# Altium project roneMotorBoard-v9.PrjPCB
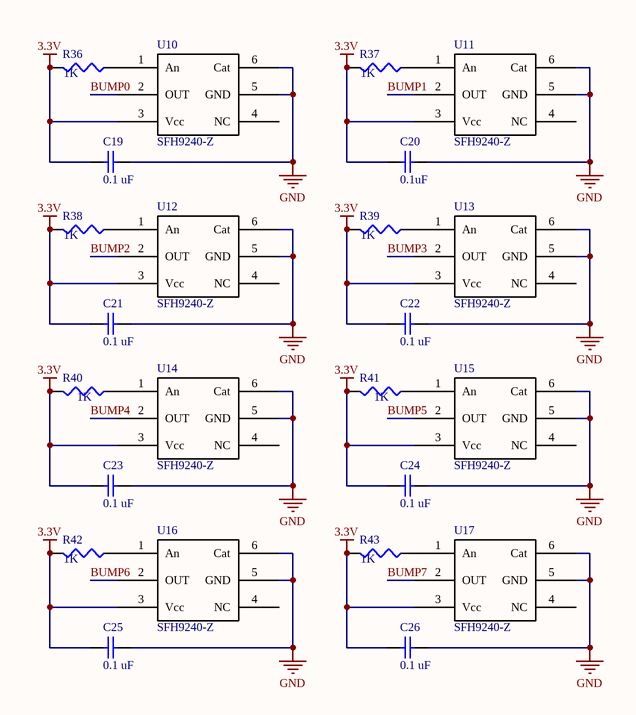
[diagram p0: BumpSensors.SchDoc]
6 sheets, 104 parts. Net scope: global (net labels, ports and power ports of the same name join across sheets).
Board file: roneMotorBoard-v9.PcbDoc
Sheets:
  BumpSensors.SchDoc
  GyroAccelHeaders.SchDoc
  LineCliffSensors.SchDoc
  motorEncoder.SchDoc
  MSP430.SchDoc
  Power.SchDoc

## Sheet BumpSensors.SchDoc
size A

### Parts
C19  value 0.1 uF  [CAPC1005L]  (hidden comment: Cap Semi)
C20  value 0.1uF  [CAPC1005L]  (hidden comment: Cap Semi)
C21  value 0.1 uF  [CAPC1005L]  (hidden comment: Cap Semi)
C22  value 0.1 uF  [CAPC1005L]  (hidden comment: Cap Semi)
C23  value 0.1 uF  [CAPC1005L]  (hidden comment: Cap Semi)
C24  value 0.1 uF  [CAPC1005L]  (hidden comment: Cap Semi)
C25  value 0.1 uF  [CAPC1005L]  (hidden comment: Cap Semi)
C26  value 0.1 uF  [CAPC1005L]  (hidden comment: Cap Semi)
R36  value 1K  [RESC1608L]  (hidden comment: Res3)
R37  value 1K  [RESC1608L]  (hidden comment: Res3)
R38  value 1K  [RESC1608L]  (hidden comment: Res3)
R39  value 1K  [RESC1608L]  (hidden comment: Res3)
R40  value 1K  [RESC1608L]  (hidden comment: Res3)
R41  value 1K  [RESC1608L]  (hidden comment: Res3)
R42  value 1K  [RESC1608L]  (hidden comment: Res3)
R43  value 1K  [RESC1608L]  (hidden comment: Res3)
U10  SFH9240-Z  [SFH9240-Z]
U11  SFH9240-Z  [SFH9240-Z]
U12  SFH9240-Z  [SFH9240-Z]
U13  SFH9240-Z  [SFH9240-Z]
U14  SFH9240-Z  [SFH9240-Z]
U15  SFH9240-Z  [SFH9240-Z]
U16  SFH9240-Z  [SFH9240-Z]
U17  SFH9240-Z  [SFH9240-Z]

### Nets
3.3V: C19.2 C20.2 C21.2 C22.2 C23.2 C24.2 C25.2 C26.2 R36.2 R37.2 R38.2 R39.2 R40.2 R41.2 R42.2 R43.2 U10.3(Vcc) U11.3(Vcc) U12.3(Vcc) U13.3(Vcc) U14.3(Vcc) U15.3(Vcc) U16.3(Vcc) U17.3(Vcc)
GND: C19.1 C20.1 C21.1 C22.1 C23.1 C24.1 C25.1 C26.1 U10.5(GND) U10.6(Cat) U11.5(GND) U11.6(Cat) U12.5(GND) U12.6(Cat) U13.5(GND) U13.6(Cat) U14.5(GND) U14.6(Cat) U15.5(GND) U15.6(Cat) U16.5(GND) U16.6(Cat) U17.5(GND) U17.6(Cat)
BUMP0: U10.2(OUT)
BUMP1: U11.2(OUT)
BUMP2: U12.2(OUT)
BUMP3: U13.2(OUT)
BUMP4: U14.2(OUT)
BUMP5: U15.2(OUT)
BUMP6: U16.2(OUT)
BUMP7: U17.2(OUT)
NetR36_1: R36.1 U10.1(An)
NetR37_1: R37.1 U11.1(An)
NetR38_1: R38.1 U12.1(An)
NetR39_1: R39.1 U13.1(An)
NetR40_1: R40.1 U14.1(An)
NetR41_1: R41.1 U15.1(An)
NetR42_1: R42.1 U16.1(An)
NetR43_1: R43.1 U17.1(An)

Not connected (* = marked no-connect by the designer): U10 4(NC); U11 4(NC); U12 4(NC); U13 4(NC); U14 4(NC); U15 4(NC); U16 4(NC); U17 4(NC)

### Library data of the parts
C19-C26 = Cap Semi: Capacitor (Semiconductor SIM Model); Published: 8-Jun-2000; LatestRevisionDate: 29-May-2009; LatestRevisionNote: IPC-7351 Footprint Added.; PackageReference: C1206; Publisher: Altium Limited; PackageDescription: Chip Capacitor
R36-R43 = Res3: Resistor; Published: 8-Jun-2000; LatestRevisionDate: 29-May-2009; LatestRevisionNote: IPC-7351 Footprint Added.; PackageReference: J1-0603; Publisher: Altium Limited; PackageDescription: Chip Resistor

## Sheet GyroAccelHeaders.SchDoc
size A
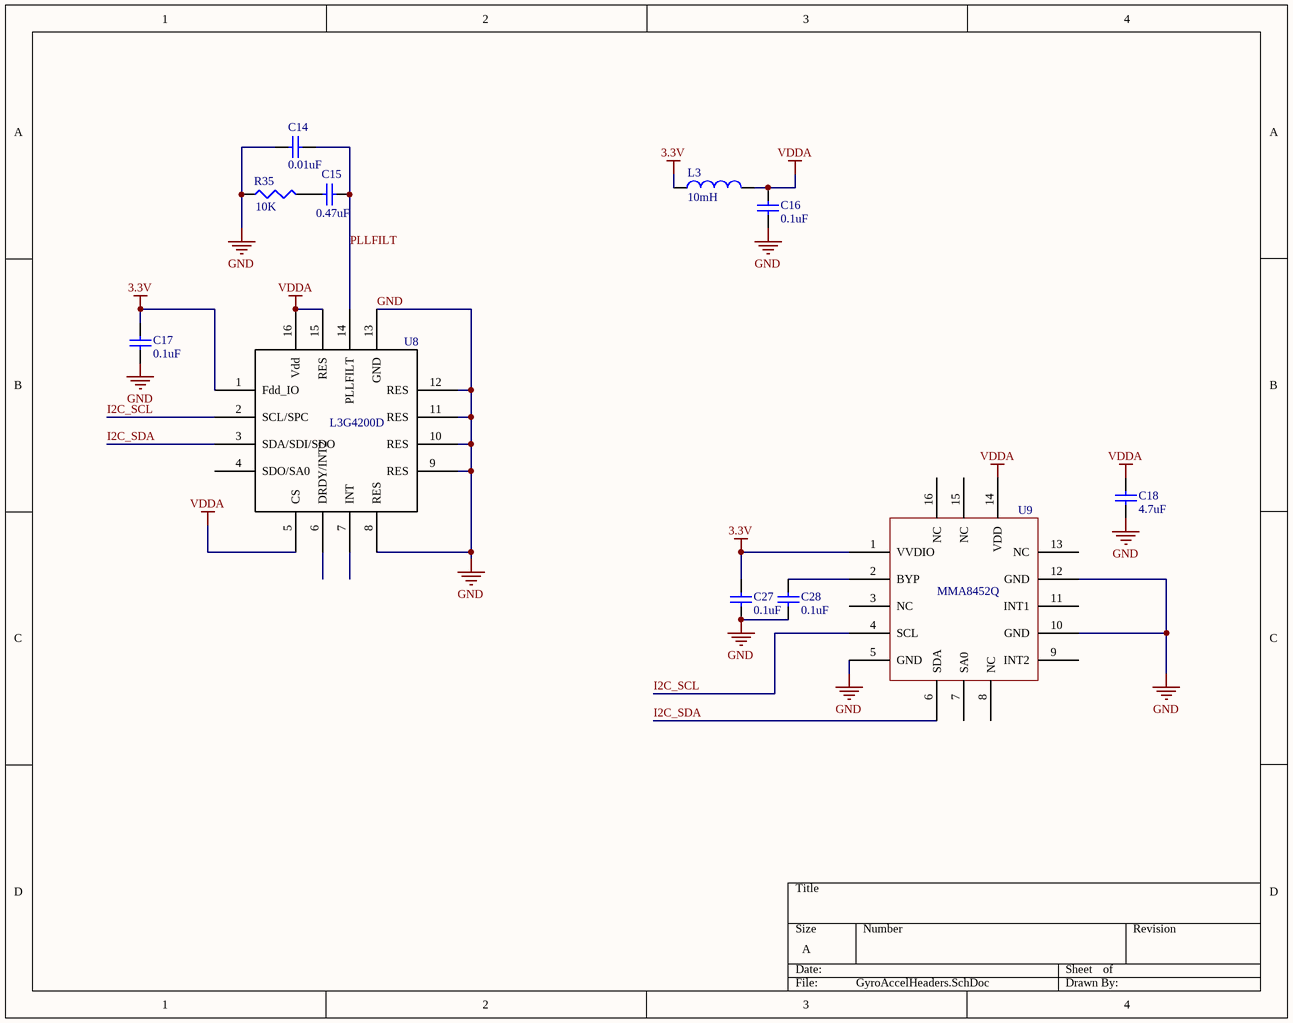
[diagram p1: GyroAccelHeaders.SchDoc]

### Parts
C14  value 0.01uF  [CAPC1005L]  (hidden comment: Cap Semi)
C15  value 0.47uF  [CAPC1005L]  (hidden comment: Cap Semi)
C16  value 0.1uF  [CAPC1005L]  (hidden comment: Cap Semi)
C17  value 0.1uF  [CAPC1005L]  (hidden comment: Cap Semi)
C18  value 4.7uF  [CAPC1005L]  (hidden comment: Cap Semi)
C27  value 0.1uF  [CAPC1005L]  (hidden comment: Cap Semi)
C28  value 0.1uF  [CAPC1005L]  (hidden comment: Cap Semi)
L3  value 10mH  [INDC2012L]  (hidden comment: Inductor)
R35  value 10K  [RESC1608L]  (hidden comment: Res3)
U8  L3G4200D  [L3G2004D]
U9  MMA8452Q  [MMA8452Q]

### Nets
3.3V: C17.2 C27.2 L3.2 U8.1(Fdd_IO) U9.1(VVDIO)
GND: C14.2 C16.1 C17.1 C18.1 C27.1 C28.1 R35.1 U8.8(RES) U8.9(RES) U8.10(RES) U8.11(RES) U8.12(RES) U8.13(GND) U9.5(GND) U9.10(GND) U9.12(GND)
VDDA: C16.2 C18.2 L3.1 U8.5(CS) U8.15(RES) U8.16(Vdd) U9.14(VDD)
I2C_SCL: U8.2(SCL/SPC) U9.4(SCL)
I2C_SDA: U8.3(SDA/SDI/SDO) U9.6(SDA)
PLLFILT: C14.1 C15.1 U8.14(PLLFILT)
NetC15_2: C15.2 R35.2
NetC28_2: C28.2 U9.2(BYP)

Not connected (* = marked no-connect by the designer): U8 4(SDO/SA0) 6(DRDY/INT2) 7(INT); U9 3(NC) 7(SA0) 8(NC) 9(INT2) 11(INT1) 13(NC) 15(NC) 16(NC)

### Library data of the parts
C14-C18 C27 C28 = Cap Semi: Capacitor (Semiconductor SIM Model); Published: 8-Jun-2000; LatestRevisionDate: 29-May-2009; LatestRevisionNote: IPC-7351 Footprint Added.; PackageReference: C1206; Publisher: Altium Limited; PackageDescription: Chip Capacitor
L3 = Inductor: Code_IEC: 1005; Published: 8-Jun-2000; LatestRevisionDate: 29-May-2009; LatestRevisionNote: IPC-7351 Footprint Added.; PackageReference: 0402-A; Publisher: Altium Limited; PackageDescription: Chip Inductor; Code_JEITA: 0402
R35 = Res3: Resistor; Published: 8-Jun-2000; LatestRevisionDate: 29-May-2009; LatestRevisionNote: IPC-7351 Footprint Added.; PackageReference: J1-0603; Publisher: Altium Limited; PackageDescription: Chip Resistor
U8 = L3G4200D: 3axis gyroscope, SPI

## Sheet LineCliffSensors.SchDoc
size A
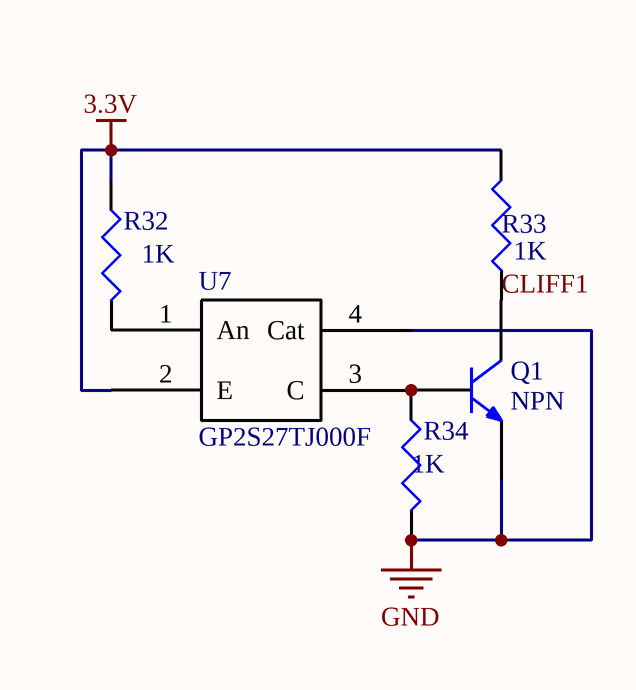
[diagram p2: LineCliffSensors.SchDoc]

### Parts
Q1  NPN  [SOT-23]
R32  value 1K  [RESC1608L]  (hidden comment: Res3)
R33  value 1K  [RESC1608L]  (hidden comment: Res3)
R34  value 1K  [RESC1608L]  (hidden comment: Res3)
U7  GP2S27TJ000F  [GP2S27J0000F]

### Nets
3.3V: R32.1 R33.2 U7.2(E)
GND: Q1.2(E) R34.2 U7.4(Cat)
CLIFF1: Q1.3(C) R33.1
NetQ1_1: Q1.1(B) R34.1 U7.3(C)
NetR32_2: R32.2 U7.1(An)

### Library data of the parts
R32-R34 = Res3: Resistor; Published: 8-Jun-2000; LatestRevisionDate: 29-May-2009; LatestRevisionNote: IPC-7351 Footprint Added.; PackageReference: J1-0603; Publisher: Altium Limited; PackageDescription: Chip Resistor

## Sheet motorEncoder.SchDoc
size A
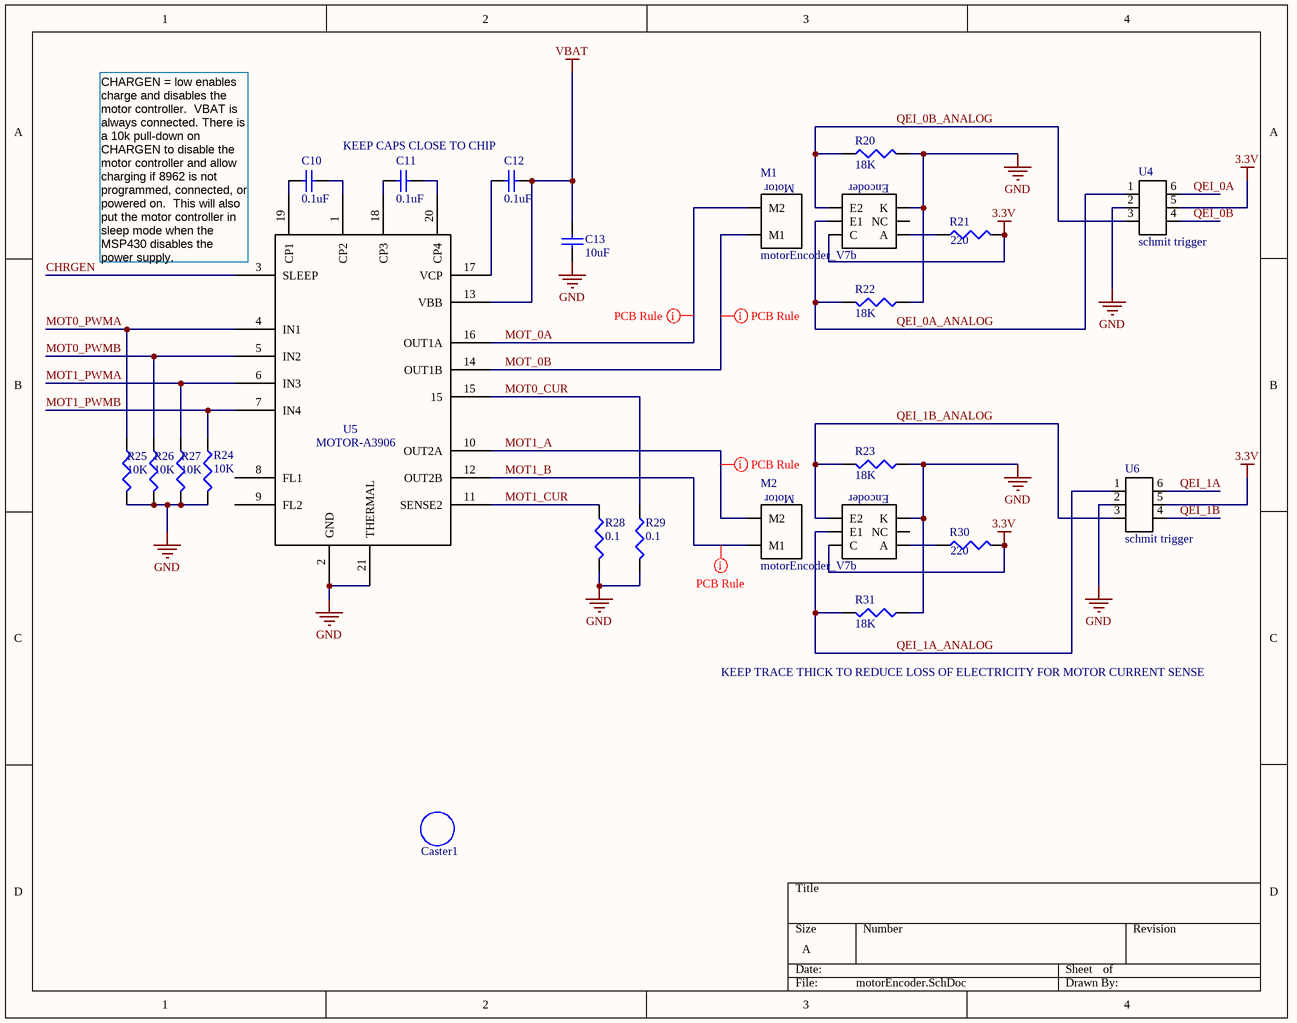
[diagram p3: motorEncoder.SchDoc]

### Parts
C10  value 0.1uF  [CAPC1005L]  (hidden comment: Cap Semi)
C11  value 0.1uF  [CAPC1005L]  (hidden comment: Cap Semi)
C12  value 0.1uF  [CAPC1005L]  (hidden comment: Cap Semi)
C13  value 10uF  [CAPC1608L]  (hidden comment: Cap Semi)
Caster1  non connect  [3/4"CASTER2]  (value not drawn)
M1  motorEncoder_V7b  [motorEncoder_V7b]
M2  motorEncoder_V7b  [motorEncoder_V7b]
R20  value 18K  [RESC1608L]
R21  value 220  [RESC1608L]
R22  value 18K  [RESC1608L]
R23  value 18K  [RESC1608L]
R24  value 10K  [RESC1608L]  (hidden comment: Res3)
R25  value 10K  [RESC1608L]  (hidden comment: Res3)
R26  value 10K  [RESC1608L]  (hidden comment: Res3)
R27  value 10K  [RESC1608L]  (hidden comment: Res3)
R28  value 0.1  [RESC1608L]  (hidden comment: Res3)
R29  value 0.1  [RESC1608L]  (hidden comment: Res3)
R30  value 220  [RESC1608L]
R31  value 18K  [RESC1608L]
U4  schmit trigger  [DCK(R-PDSO-C6)]
U5  MOTOR-A3906  [QFN-20]
U6  schmit trigger  [DCK(R-PDSO-C6)]

### Nets
3.3V: M1.C M2.C R21.2 R30.2 U4.5 U6.5
GND: C13.1 M1.K M2.K R20.2 R22.1 R23.1 R24.2 R25.2 R26.2 R27.2 R28.2 R29.2 R31.1 U4.2 U5.2(GND) U5.21(THERMAL) U6.2
VBAT: C12.1 C13.2 U5.13(VBB)
CHRGEN: U5.3(SLEEP)
MOT0_CUR: R29.1 U5.15
MOT0_PWMA: R25.1 U5.4(IN1)
MOT0_PWMB: R26.1 U5.5(IN2)
MOT1_A: M2.M2 U5.10(OUT2A)
MOT1_B: M2.M1 U5.12(OUT2B)
MOT1_CUR: R28.1 U5.11(SENSE2)
MOT1_PWMA: R27.1 U5.6(IN3)
MOT1_PWMB: R24.1 U5.7(IN4)
MOT_0A: M1.M2 U5.16(OUT1A)
MOT_0B: M1.M1 U5.14(OUT1B)
QEI_0A: U4.6
QEI_0A_ANALOG: M1.E1 R22.2 U4.1
QEI_0B: U4.4
QEI_0B_ANALOG: M1.E2 R20.1 U4.3
QEI_1A: U6.6
QEI_1A_ANALOG: M2.E1 R31.2 U6.1
QEI_1B: U6.4
QEI_1B_ANALOG: M2.E2 R23.2 U6.3
NetC10_1: C10.1 U5.19(CP1)
NetC10_2: C10.2 U5.1(CP2)
NetC11_1: C11.1 U5.18(CP3)
NetC11_2: C11.2 U5.20(CP4)
NetC12_2: C12.2 U5.17(VCP)
NetM1_A: M1.A R21.1
NetM2_A: M2.A R30.1

Not connected (* = marked no-connect by the designer): M1 NC; M2 NC; U5 8(FL1) 9(FL2)

### Layout directives
rule Width Constraint [Pref Width = 20mil    Min Width = 10mil    Max Width = 25mil]: MOT1_A, MOT1_B, MOT_0A, MOT_0B

### Notes on the sheet
- KEEP CAPS CLOSE TO CHIP
- (near U5) CHARGEN = low enables charge and disables the motor controller.  VBAT is always connected. There is a 10k pull-down on CHARGEN to disable the motor controller and allow charging if 8962 is not programmed, connected, or powered on.  This will also put the motor controller in sleep mode when the MSP430 disables the power supply.
- KEEP TRACE THICK TO REDUCE LOSS OF ELECTRICITY FOR MOTOR CURRENT SENSE
- (in symbol motorEncoder_V7b) Motor; Encoder

### Library data of the parts
C10-C13 = Cap Semi: Capacitor (Semiconductor SIM Model); Published: 8-Jun-2000; LatestRevisionDate: 29-May-2009; LatestRevisionNote: IPC-7351 Footprint Added.; PackageReference: C1206; Publisher: Altium Limited; PackageDescription: Chip Capacitor
Caster1 = Caster 3/4in: This is just a space saver to get the caster onto the pcb
R20-R31 = Res3: Resistor; Published: 8-Jun-2000; LatestRevisionDate: 29-May-2009; LatestRevisionNote: IPC-7351 Footprint Added.; PackageReference: J1-0603; Publisher: Altium Limited; PackageDescription: Chip Resistor

## Sheet MSP430.SchDoc
size A
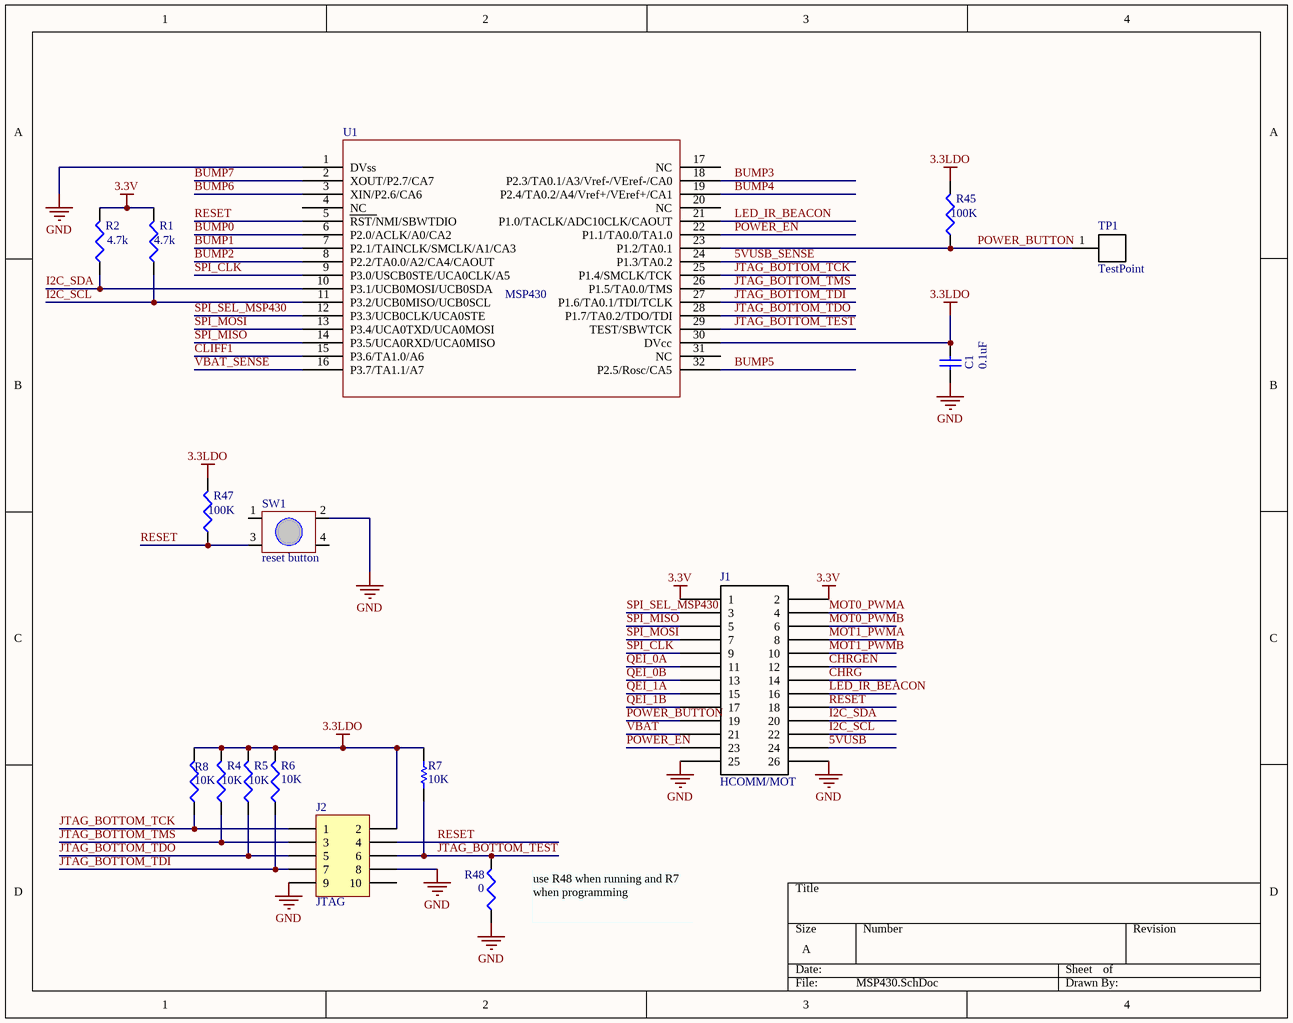
[diagram p4: MSP430.SchDoc]

### Parts
C1  value 0.1uF  [CAPC1005L]  (hidden comment: Cap Semi)
J1  HCOMM/MOT  [HeaderSM 13x2]
J2  JTAG  [HDR2X5]
R1  value 4.7k  [RESC1608L]  (hidden comment: Res3)
R2  value 4.7k  [RESC1608L]  (hidden comment: Res3)
R4  value 10K  [RESC1608L]  (hidden comment: Res3)
R5  value 10K  [RESC1608L]  (hidden comment: Res3)
R6  value 10K  [RESC1608L]  (hidden comment: Res3)
R7  value 10K  [RESC1608L]  (hidden comment: Res Semi)
R8  value 10K  [RESC1608L]  (hidden comment: Res3)
R45  value 100K  [RESC1608L]  (hidden comment: Res3)
R47  value 100K  [RESC1608L]  (hidden comment: Res3)
R48  value 0  [RESC1608L]  (hidden comment: Res3)
SW1  reset button  [SwitchTall-TL330]
TP1  TestPoint  [TestPoint]
U1  MSP430  [MSP430_32PIN]

### Nets
3.3LDO: C1.2 J2.2 R4.2 R5.2 R6.2 R7.2 R8.2 R45.2 R47.2 U1.30(DVcc)
3.3V: J1.1 J1.2 R1.2 R2.2
5VUSB: J1.24
GND: C1.1 J1.25 J1.26 J2.8 J2.9 R48.1 SW1.2 U1.1(DVss)
VBAT: J1.21
5VUSB_SENSE: U1.24(P1.3/TA0.2)
BUMP0: U1.6(P2.0/ACLK/A0/CA2)
BUMP1: U1.7(P2.1/TAINCLK/SMCLK/A1/CA3)
BUMP2: U1.8(P2.2/TA0.0/A2/CA4/CAOUT)
BUMP3: U1.18(P2.3/TA0.1/A3/Vref-/VEref-/CA0)
BUMP4: U1.19(P2.4/TA0.2/A4/Vref+/VEref+/CA1)
BUMP5: U1.32(P2.5/Rosc/CA5)
BUMP6: U1.3(XIN/P2.6/CA6)
BUMP7: U1.2(XOUT/P2.7/CA7)
CHRG: J1.14
CHRGEN: J1.12
CLIFF1: U1.15(P3.6/TA1.0/A6)
I2C_SCL: J1.22 R1.1 U1.11(P3.2/UCB0MISO/UCB0SCL)
I2C_SDA: J1.20 R2.1 U1.10(P3.1/UCB0MOSI/UCB0SDA)
JTAG_BOTTOM_TCK: J2.1 R8.1 U1.25(P1.4/SMCLK/TCK)
JTAG_BOTTOM_TDI: J2.7 R6.1 U1.27(P1.6/TA0.1/TDI/TCLK)
JTAG_BOTTOM_TDO: J2.5 R5.1 U1.28(P1.7/TA0.2/TDO/TDI)
JTAG_BOTTOM_TEST: J2.6 R7.1 R48.2 U1.29(TEST/SBWTCK)
JTAG_BOTTOM_TMS: J2.3 R4.1 U1.26(P1.5/TA0.0/TMS)
LED_IR_BEACON: J1.16 U1.21(P1.0/TACLK/ADC10CLK/CAOUT)
MOT0_PWMA: J1.4
MOT0_PWMB: J1.6
MOT1_PWMA: J1.8
MOT1_PWMB: J1.10
POWER_BUTTON: J1.19 R45.1 TP1.1 U1.23(P1.2/TA0.1)
POWER_EN: J1.23 U1.22(P1.1/TA0.0/TA1.0)
QEI_0A: J1.11
QEI_0B: J1.13
QEI_1A: J1.15
QEI_1B: J1.17
RESET: J1.18 J2.4 R47.1 SW1.3 U1.5(RST/NMI/SBWTDIO)
SPI_CLK: J1.9 U1.9(P3.0/USCB0STE/UCA0CLK/A5)
SPI_MISO: J1.5 U1.14(P3.5/UCA0RXD/UCA0MISO)
SPI_MOSI: J1.7 U1.13(P3.4/UCA0TXD/UCA0MOSI)
SPI_SEL_MSP430: J1.3 U1.12(P3.3/UCB0CLK/UCA0STE)
VBAT_SENSE: U1.16(P3.7/TA1.1/A7)

Not connected (* = marked no-connect by the designer): J2 10; SW1 1 4; U1 4(NC) 17(NC) 20(NC) 31(NC)

### Notes on the sheet
- (near R48) use R48 when running and R7 when programming

### Library data of the parts
C1 = Cap Semi: Capacitor (Semiconductor SIM Model); Published: 8-Jun-2000; LatestRevisionDate: 29-May-2009; LatestRevisionNote: IPC-7351 Footprint Added.; PackageReference: C1206; Publisher: Altium Limited; PackageDescription: Chip Capacitor
J1 = HCOMM/HMOT: Header, 2X20, 50mil, IDC
J2 = Header 5X2: Header, 5-Pin, Dual row; LatestRevisionDate: 17-Jul-2002; LatestRevisionNote: Re-released for DXP Platform.; Publisher: Altium Limited
R1 R2 R4-R6 R8 R45 R47 R48 = Res3: Resistor; Published: 8-Jun-2000; LatestRevisionDate: 29-May-2009; LatestRevisionNote: IPC-7351 Footprint Added.; PackageReference: J1-0603; Publisher: Altium Limited; PackageDescription: Chip Resistor
R7 = Res Semi: Semiconductor Resistor; Published: 8-Jun-2000; LatestRevisionDate: 17-Jul-2002; LatestRevisionNote: Re-released for DXP Platform.; PackageReference: AXIAL-0.5; Publisher: Altium Limited
SW1 = Switch-TL330
U1 = MSP430_32pin

## Sheet Power.SchDoc
size A
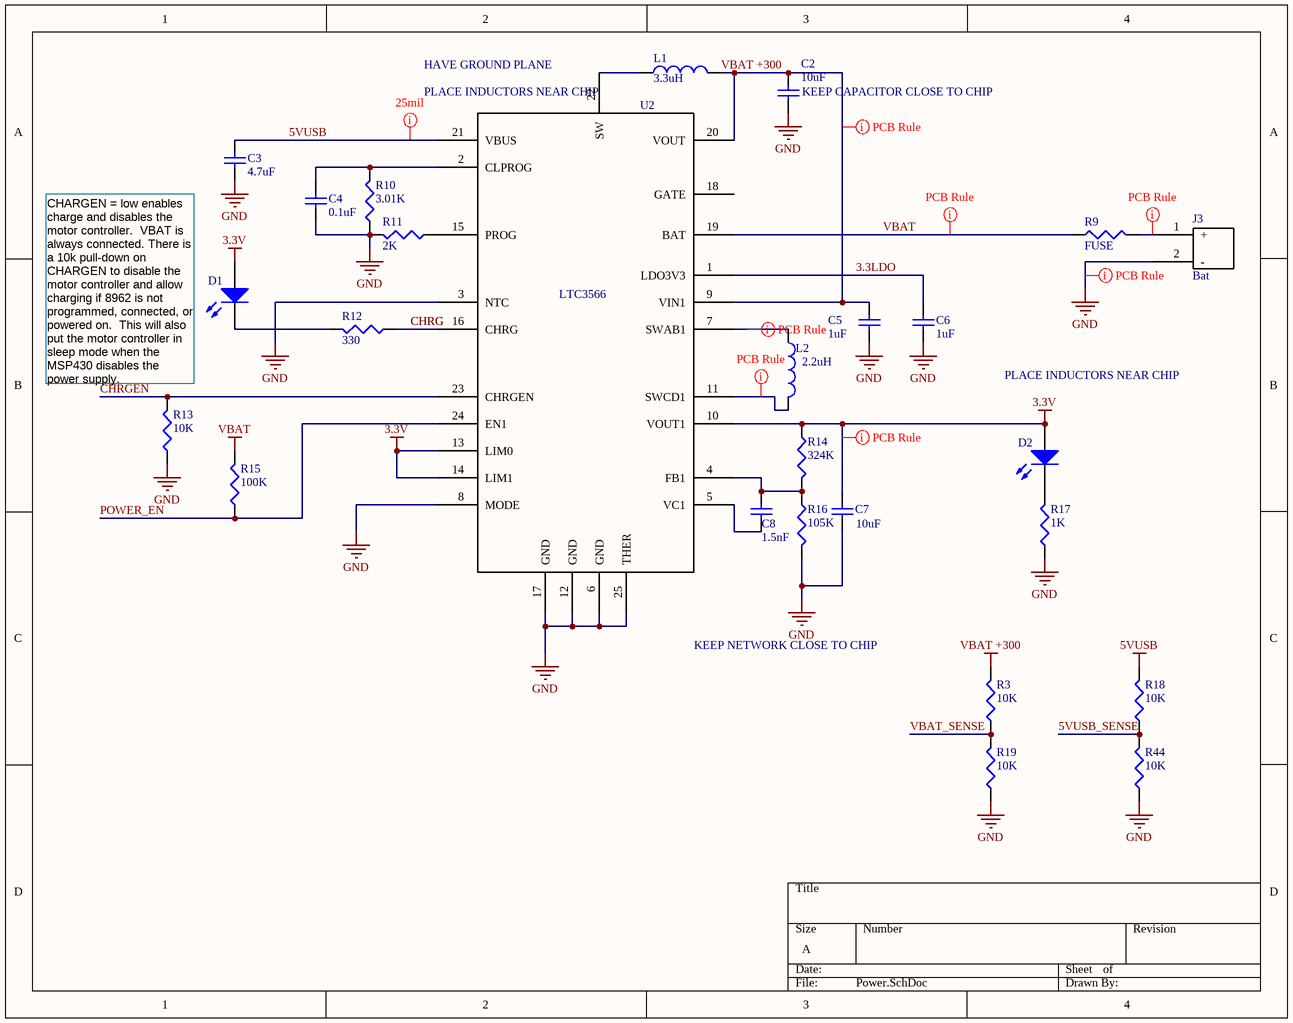
[diagram p5: Power.SchDoc]

### Parts
C2  value 10uF  [CAPC1608L]  (hidden comment: Cap)
C3  value 4.7uF  [CAPC1608L]  (hidden comment: Cap)
C4  value 0.1uF  [CAPC1005L]  (hidden comment: Cap)
C5  value 1uF  [CAPC1608L]  (hidden comment: Cap)
C6  value 1uF  [CAPC1608L]  (hidden comment: Cap)
C7  value 10uF  [CAPC1608L]  (hidden comment: Cap)
C8  value 1.5nF  [CAPC1005L]  (hidden comment: Cap)
D1  Charge  [INDC2012L]  (value not drawn)
D2  Power  [INDC2012L]  (value not drawn)
J3  Bat  [BatteryConnJST]
L1  3.3uH  [IndPow]
L2  2.2uH  [IndPow]
R3  value 10K  [RESC1608L]  (hidden comment: Res3)
R9  value FUSE  [RESC3225L]  (hidden comment: Res3)
R10  value 3.01K  [RESC1608L]  (hidden comment: Res3)
R11  value 2K  [RESC1608L]  (hidden comment: Res3)
R12  value 330  [RESC1608L]  (hidden comment: Res3)
R13  value 10K  [RESC1608L]  (hidden comment: Res3)
R14  value 324K  [RESC1608L]  (hidden comment: Res3)
R15  value 100K  [RESC1608L]  (hidden comment: Res3)
R16  value 105K  [RESC1608L]  (hidden comment: Res3)
R17  value 1K  [RESC1608L]  (hidden comment: Res3)
R18  value 10K  [RESC1608L]  (hidden comment: Res3)
R19  value 10K  [RESC1608L]  (hidden comment: Res3)
R44  value 10K  [RESC1608L]  (hidden comment: Res3)
U2  LTC3566  [QFN-24]

### Nets
3.3LDO: C6.1 U2.1(LDO3V3)
3.3V: C7.2 D1.1(A) D2.1(A) R14.1 U2.10(VOUT1) U2.13(LIM0) U2.14(LIM1)
5VUSB: C3.2 R18.2 U2.21(VBUS)
GND: C2.1 C3.1 C4.1 C5.2 C6.2 C7.1 J3.2(-) R10.1 R11.2 R13.1 R16.2 R17.1 R19.1 R44.1 U2.3(NTC) U2.6(GND) U2.8(MODE) U2.12(GND) U2.17(GND) U2.25(THER)
VBAT: R9.1 R15.2 U2.19(BAT)
VBAT +300: C2.2 C5.1 L1.2 R3.2 U2.9(VIN1) U2.20(VOUT)
5VUSB_SENSE: R18.1 R44.2
CHRG: R12.1 U2.16(CHRG)
CHRGEN: R13.2 U2.23(CHRGEN)
POWER_EN: R15.1 U2.24(EN1)
VBAT_SENSE: R3.1 R19.2
NetC4_2: C4.2 R10.2 U2.2(CLPROG)
NetC8_1: C8.1 R14.2 R16.1 U2.4(FB1)
NetC8_2: C8.2 U2.5(VC1)
NetD1_2: D1.2(K) R12.2
NetD2_2: D2.2(K) R17.2
NetJ3_1: J3.1(+) R9.2
NetL1_1: L1.1 U2.22(SW)
NetL2_1: L2.1 U2.7(SWAB1)
NetL2_2: L2.2 U2.11(SWCD1)
NetR11_1: R11.1 U2.15(PROG)

Not connected (* = marked no-connect by the designer): U2 18(GATE)

### Layout directives
rule Width Constraint [Pref Width = 25mil    Min Width = 10mil    Max Width = 25mil]: 5VUSB, GND, NetJ3_1, NetL2_1, NetL2_2, VBAT +300
rule Width Constraint [Pref Width = 25mil    Min Width = 10mil    Max Width = 100mil]: 3.3V
rule Width Constraint [Pref Width = 25mil    Min Width = 10mil    Max Width = 50mil]: VBAT

### Notes on the sheet
- (near U2) HAVE GROUND PLANE
- (near U2) PLACE INDUCTORS NEAR CHIP
- (near C2) KEEP CAPACITOR CLOSE TO CHIP
- CHRG
- CHARGEN = low enables charge and disables the motor controller.  VBAT is always connected. There is a 10k pull-down on CHARGEN to disable the motor controller and allow charging if 8962 is not programmed, connected, or powered on.  This will also put the motor controller in sleep mode when the MSP430 disables the power supply.
- PLACE INDUCTORS NEAR CHIP
- KEEP NETWORK CLOSE TO CHIP

### Library data of the parts
C2-C8 = Cap: Capacitor; Published: 8-Jun-2000; LatestRevisionDate: 17-Jul-2002; LatestRevisionNote: Re-released for DXP Platform.; PackageReference: RAD-0.3; Publisher: Altium Limited
D1 D2 = LED2: Typical RED, GREEN, YELLOW, AMBER GaAs LED; Published: 8-Jun-2000; LatestRevisionDate: 17-Jul-2002; LatestRevisionNote: Re-released for DXP Platform.; PackageVersion: Feb-2002; PackageReference: 3.2X1.6X1.1; Publisher: Altium Limited
J3 = BatteryConnJST
L1 L2 = Inductor
  L1: Value: 3.3uH
  L2: Value: 2.2uH
R3 R9-R19 R44 = Res3: Resistor; Published: 8-Jun-2000; LatestRevisionDate: 29-May-2009; LatestRevisionNote: IPC-7351 Footprint Added.; PackageReference: J1-0603; Publisher: Altium Limited; PackageDescription: Chip Resistor

## Nets that join several sheets
3.3LDO: MSP430 (10 pins), Power (C6.1 U2.1)
3.3V: BumpSensors (24 pins), GyroAccelHeaders (5 pins), LineCliffSensors (R32.1 R33.2 U7.2), motorEncoder (6 pins), MSP430 (J1.1 J1.2 R1.2 R2.2), Power (7 pins)
5VUSB: MSP430 (J1.24), Power (C3.2 R18.2 U2.21)
GND: BumpSensors (24 pins), GyroAccelHeaders (16 pins), LineCliffSensors (Q1.2 R34.2 U7.4), motorEncoder (17 pins), MSP430 (8 pins), Power (20 pins)
VBAT: motorEncoder (C12.1 C13.2 U5.13), MSP430 (J1.21), Power (R9.1 R15.2 U2.19)
5VUSB_SENSE: MSP430 (U1.24), Power (R18.1 R44.2)
BUMP0: BumpSensors (U10.2), MSP430 (U1.6)
BUMP1: BumpSensors (U11.2), MSP430 (U1.7)
BUMP2: BumpSensors (U12.2), MSP430 (U1.8)
BUMP3: BumpSensors (U13.2), MSP430 (U1.18)
BUMP4: BumpSensors (U14.2), MSP430 (U1.19)
BUMP5: BumpSensors (U15.2), MSP430 (U1.32)
BUMP6: BumpSensors (U16.2), MSP430 (U1.3)
BUMP7: BumpSensors (U17.2), MSP430 (U1.2)
CHRG: MSP430 (J1.14), Power (R12.1 U2.16)
CHRGEN: motorEncoder (U5.3), MSP430 (J1.12), Power (R13.2 U2.23)
CLIFF1: LineCliffSensors (Q1.3 R33.1), MSP430 (U1.15)
I2C_SCL: GyroAccelHeaders (U8.2 U9.4), MSP430 (J1.22 R1.1 U1.11)
I2C_SDA: GyroAccelHeaders (U8.3 U9.6), MSP430 (J1.20 R2.1 U1.10)
MOT0_PWMA: motorEncoder (R25.1 U5.4), MSP430 (J1.4)
MOT0_PWMB: motorEncoder (R26.1 U5.5), MSP430 (J1.6)
MOT1_PWMA: motorEncoder (R27.1 U5.6), MSP430 (J1.8)
MOT1_PWMB: motorEncoder (R24.1 U5.7), MSP430 (J1.10)
POWER_EN: MSP430 (J1.23 U1.22), Power (R15.1 U2.24)
QEI_0A: motorEncoder (U4.6), MSP430 (J1.11)
QEI_0B: motorEncoder (U4.4), MSP430 (J1.13)
QEI_1A: motorEncoder (U6.6), MSP430 (J1.15)
QEI_1B: motorEncoder (U6.4), MSP430 (J1.17)
VBAT_SENSE: MSP430 (U1.16), Power (R3.1 R19.2)